# Altium schematic sheet RK3588_HDMI.SchDoc
size 420 x 297 mm; SheetNumber: 10; SheetTotal: 23
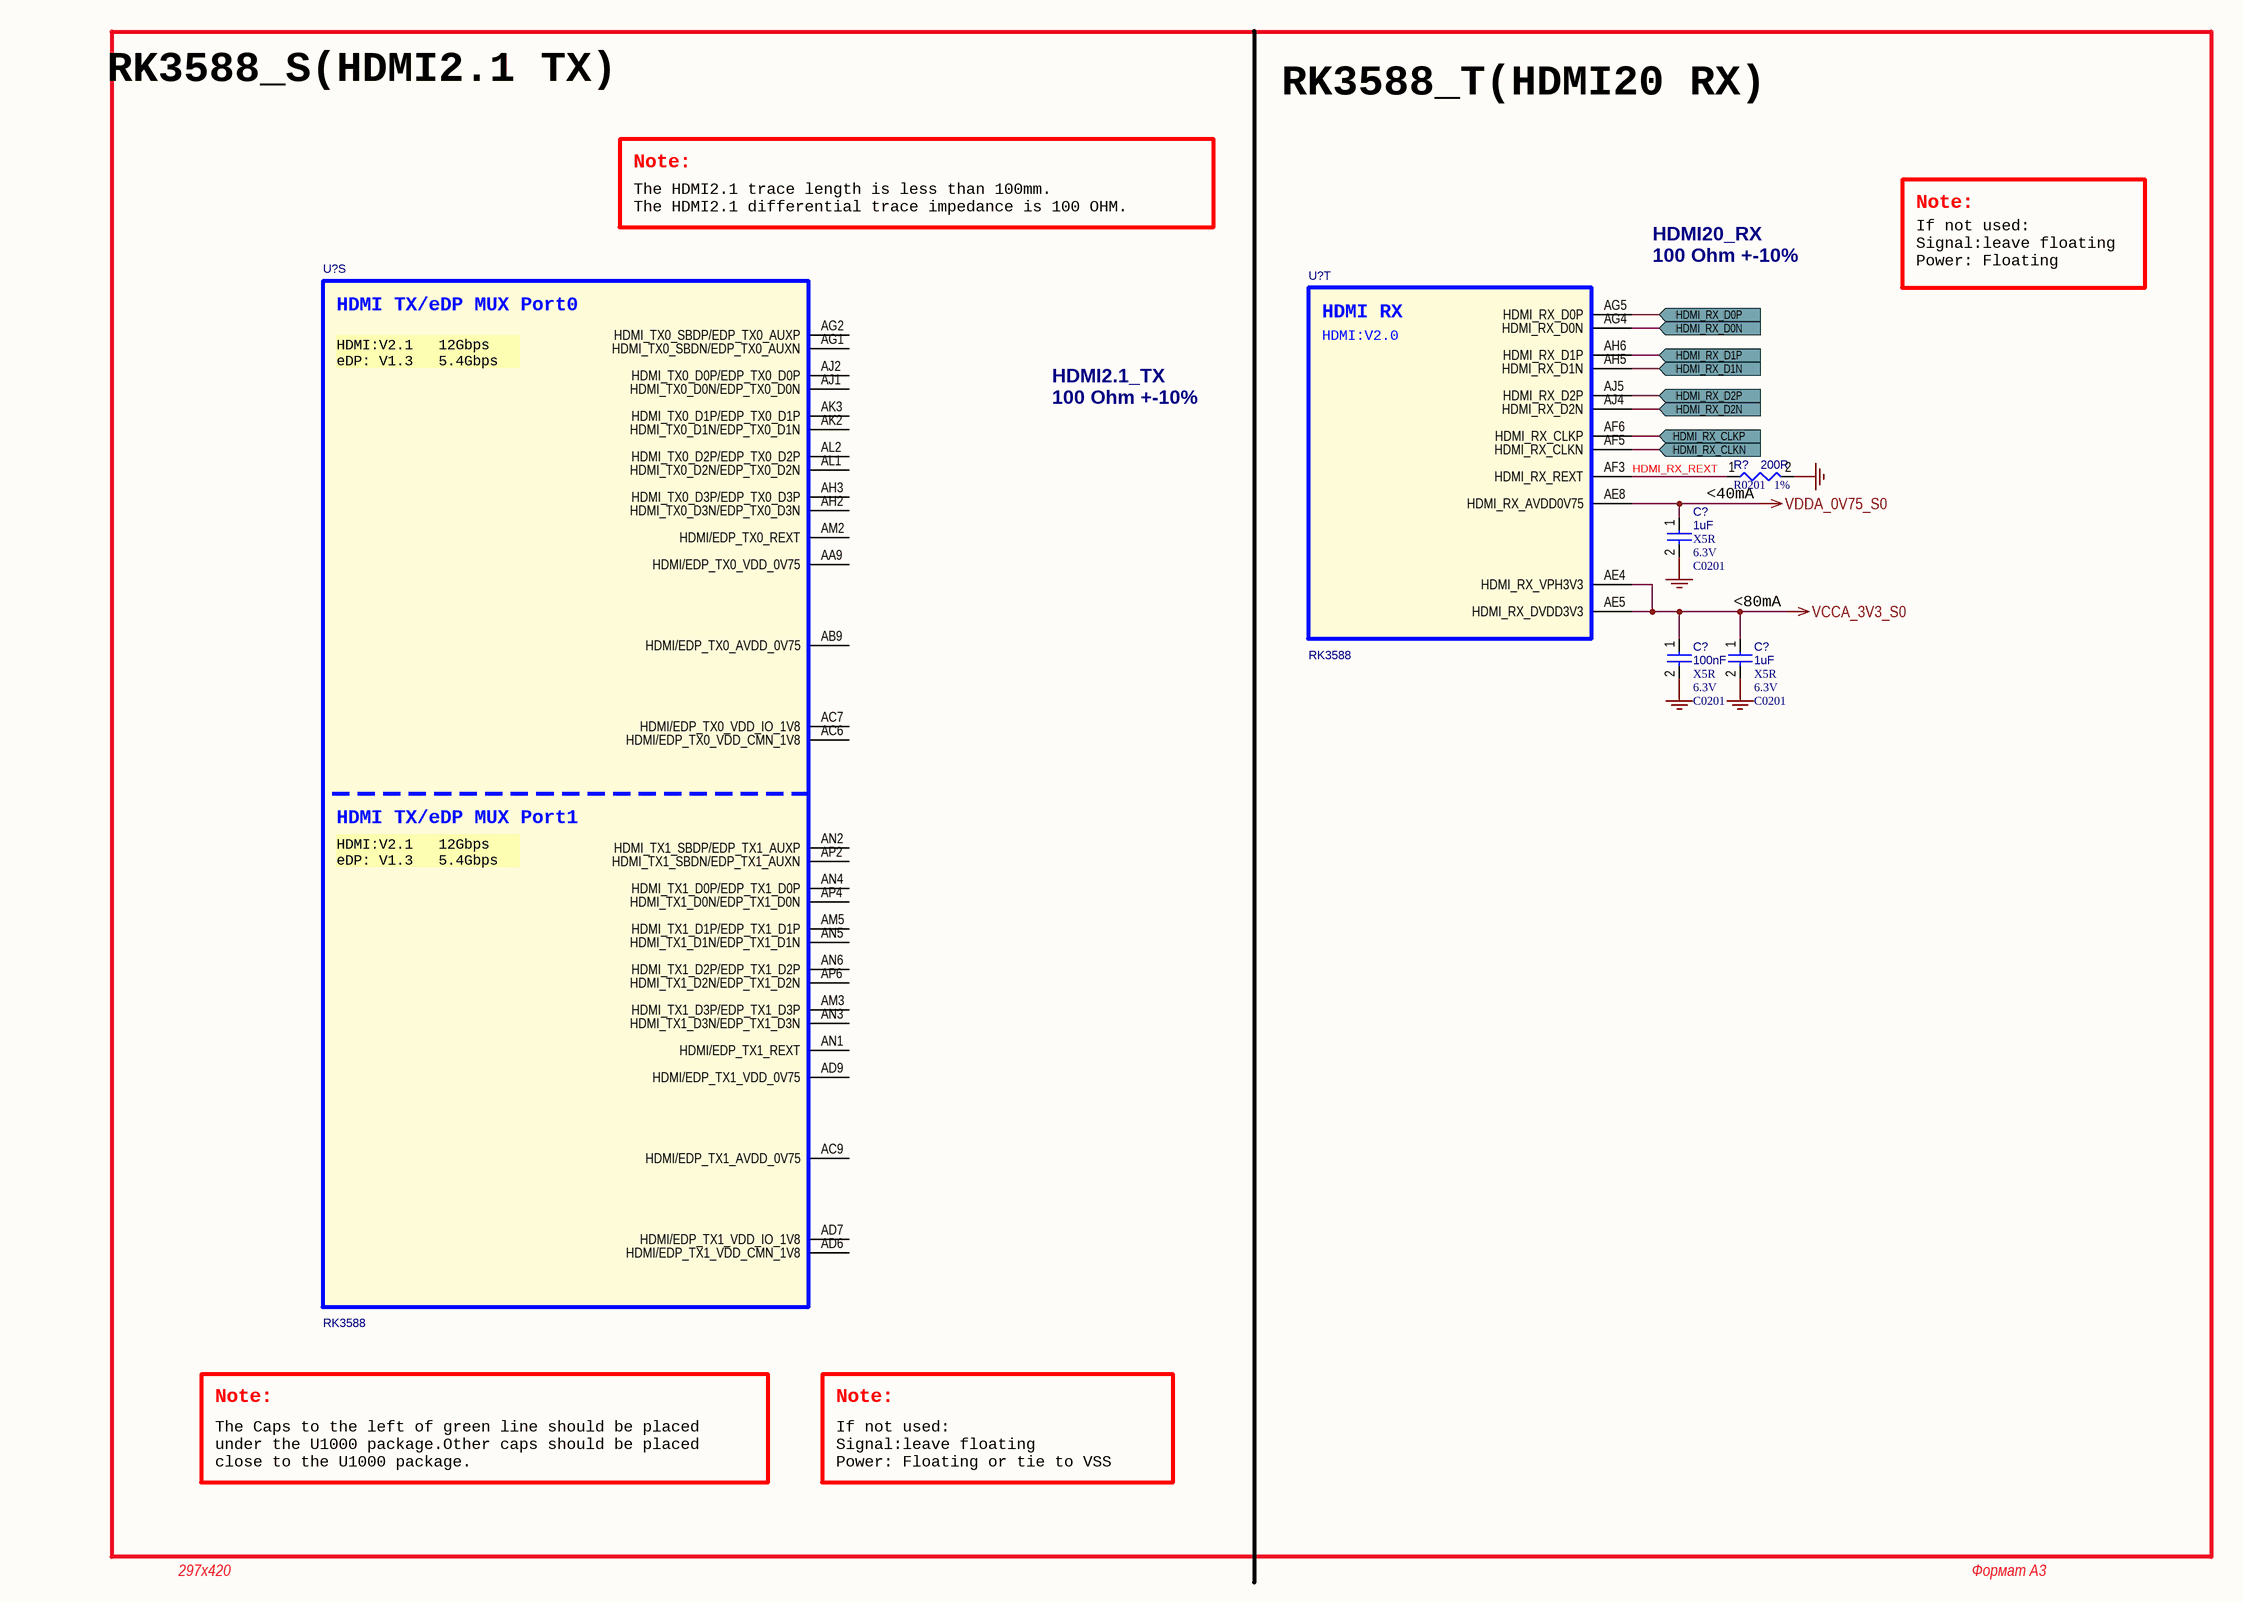
[diagram p0: RK3588_HDMI.SchDoc]

## Parts
(Parts that share a designator on the sheet are numbered #1, #2 ... from top to bottom, then left to right.)
C?#1  1uF  Dielectric: X5R  Voltage: 6.3V  [C0201]
C?#2  100nF  Dielectric: X5R  Voltage: 6.3V  [C0201]
C?#3  1uF  Dielectric: X5R  Voltage: 6.3V  [C0201]
R?  200R  Tolerance: 1%  PCB Footprint: R0201  [R0402]
U?#1  RK3588  [BGA1088_23R00X23R00X2R00]  (part S of 26)
U?#2  RK3588  [BGA1088_23R00X23R00X2R00]  (part T of 26)

## Ports
HDMI_RX_CLKN (in, see HDMI2_0_RX[3B]), HDMI_RX_CLKP (in, see HDMI2_0_RX[3B]), HDMI_RX_D0N (in, see HDMI2_0_RX[3B]), HDMI_RX_D0P (in, see HDMI2_0_RX[3B]), HDMI_RX_D1N (in, see HDMI2_0_RX[3B]), HDMI_RX_D1P (in, see HDMI2_0_RX[3B]), HDMI_RX_D2N (in, see HDMI2_0_RX[3B]), HDMI_RX_D2P (in, see HDMI2_0_RX[3B])

## Nets
GND: C?#1.2 C?#2.2 C?#3.2 R?.2
VCCA_3V3_S0: C?#2.1 C?#3.1 U?#2.AE4(HDMI_RX_VPH3V3) U?#2.AE5(HDMI_RX_DVDD3V3)
VDDA_0V75_S0: C?#1.1 U?#2.AE8(HDMI_RX_AVDD0V75)
HDMI_RX_CLKN: U?#2.AF5(HDMI_RX_CLKN) ; port HDMI_RX_CLKN
HDMI_RX_CLKP: U?#2.AF6(HDMI_RX_CLKP) ; port HDMI_RX_CLKP
HDMI_RX_D0N: U?#2.AG4(HDMI_RX_D0N) ; port HDMI_RX_D0N
HDMI_RX_D0P: U?#2.AG5(HDMI_RX_D0P) ; port HDMI_RX_D0P
HDMI_RX_D1N: U?#2.AH5(HDMI_RX_D1N) ; port HDMI_RX_D1N
HDMI_RX_D1P: U?#2.AH6(HDMI_RX_D1P) ; port HDMI_RX_D1P
HDMI_RX_D2N: U?#2.AJ4(HDMI_RX_D2N) ; port HDMI_RX_D2N
HDMI_RX_D2P: U?#2.AJ5(HDMI_RX_D2P) ; port HDMI_RX_D2P
HDMI_RX_REXT: R?.1 U?#2.AF3(HDMI_RX_REXT)

Not connected (* = marked no-connect by the designer): U?#1 AA9(HDMI/EDP_TX0_VDD_0V75) AB9(HDMI/EDP_TX0_AVDD_0V75) AC6(HDMI/EDP_TX0_VDD_CMN_1V8) AC7(HDMI/EDP_TX0_VDD_IO_1V8) AC9(HDMI/EDP_TX1_AVDD_0V75) AD6(HDMI/EDP_TX1_VDD_CMN_1V8) AD7(HDMI/EDP_TX1_VDD_IO_1V8) AD9(HDMI/EDP_TX1_VDD_0V75) AG1(HDMI_TX0_SBDN/EDP_TX0_AUXN) AG2(HDMI_TX0_SBDP/EDP_TX0_AUXP) AH2(HDMI_TX0_D3N/EDP_TX0_D3N) AH3(HDMI_TX0_D3P/EDP_TX0_D3P) AJ1(HDMI_TX0_D0N/EDP_TX0_D0N) AJ2(HDMI_TX0_D0P/EDP_TX0_D0P) AK2(HDMI_TX0_D1N/EDP_TX0_D1N) AK3(HDMI_TX0_D1P/EDP_TX0_D1P) AL1(HDMI_TX0_D2N/EDP_TX0_D2N) AL2(HDMI_TX0_D2P/EDP_TX0_D2P) AM2(HDMI/EDP_TX0_REXT) AM3(HDMI_TX1_D3P/EDP_TX1_D3P) AM5(HDMI_TX1_D1P/EDP_TX1_D1P) AN1(HDMI/EDP_TX1_REXT) AN2(HDMI_TX1_SBDP/EDP_TX1_AUXP) AN3(HDMI_TX1_D3N/EDP_TX1_D3N) AN4(HDMI_TX1_D0P/EDP_TX1_D0P) AN5(HDMI_TX1_D1N/EDP_TX1_D1N) AN6(HDMI_TX1_D2P/EDP_TX1_D2P) AP2(HDMI_TX1_SBDN/EDP_TX1_AUXN) AP4(HDMI_TX1_D0N/EDP_TX1_D0N) AP6(HDMI_TX1_D2N/EDP_TX1_D2N)

## Notes on the sheet
- RK3588_S(HDMI2.1 TX)
- RK3588_T(HDMI20 RX)
- Note:
- The HDMI2.1 trace length is less than 100mm.
  The HDMI2.1 differential trace impedance is 100 OHM.
- HDMI20_RX
  100 Ohm +-10%
- If not used:
  Signal:leave floating
  Power: Floating
- HDMI2.1_TX
  100 Ohm +-10%
- (near R?) <40mA
- (near C?#3) <80mA
- The Caps to the left of green line should be placed
  under the U1000 package.Other caps should be placed
  close to the U1000 package.
- If not used:
  Signal:leave floating
  Power: Floating or tie to VSS
- 297x420
- Формат А3
- (in symbol SOC_RK3588, part S) HDMI TX/eDP MUX Port0; HDMI:V2.1   12Gbps / eDP: V1.3   5.4Gbps; HDMI TX/eDP MUX Port1
- (in symbol SOC_RK3588, part T) HDMI RX; HDMI:V2.0

## Library data of the parts
C?#1 = CAP NP_Dup1: cap,1.00uF,+/-20%,6.3V,X5R,C0201; Part Reference: C1738; Manufacturer: TDK; RK PN: C0603X5R0J105M030BC; Priority: A; Tolerance: 20%; PCB Footprint: C0201; Value: 1uF; Part Type: C0201; Manufacturer PN: C0603X5R0J105M030BC; Created by: JJJ
C?#2 = CAP NP_Dup1: cap,100.00nF,+/-10%,6.3V,X5R,C0201; Part Reference: C1740; Manufacturer PN: C0603X5R0J104K030BC; Manufacturer: TDK; Tolerance: 10%; Priority: A; PCB Footprint: C0201; Value: 100nF; Created by: JJJ; Part Type: C0201; RK PN: C0603X5R0J104K030BC
C?#3 = CAP NP_Dup1: cap,1.00uF,+/-20%,6.3V,X5R,C0201; Part Reference: C1741; Manufacturer PN: C0603X5R0J105M030BC; Manufacturer: TDK; Tolerance: 20%; Priority: A; PCB Footprint: C0201; Value: 1uF; Created by: JJJ; Part Type: C0201; RK PN: C0603X5R0J105M030BC
R? = RESISTOR_Dup2: НЁУГєсД¤µзЧи,200R,+/-1%,R0201,1/20W.; Part Reference: R1730; Manufacturer PN: RC0201FR-07200RL; Manufacturer: YAGEO; Wattage: 1/20W; Priority: A; Value: 200R; Created by: YTL; Part Type: НЁУГєсД¤µзЧи; RK PN: RC0201FR-07200RL
U?#1 U?#2 = SOC_RK3588: ROCKCHIP SOC; Part Reference: U1000; Manufacturer: Rockchip (ИрРѕОў); SWAP_INFO: (S1+S2+S3+S4+S5+S6+S7+S8+S9+S10+S11+S12+S13+S14+S15+S16+S17+S18+S19+S20+S21+S22+S23+S24+S25+S26); SPLIT_INST: TRUE; Priority: A; Value: RK3588; PCB Footprint: BGA1088_23R00X23R00X2R00; Created by: YWQ; Manufacturer PN: RK3588; Part Type: SOC; RK PN: RK3588